# EasyEDA Pro project ProPrj_Nebula_2026-02-20 (1).epro

# Schematic Schematic1
Board Name: Board1; Create Date: 2026-02-19; Page Name: P1; Project Name: Nebula; Schematic Name: Schematic1; Update Date: 2026-02-19; Company: EasyEDA.com; Page Size: A4; Version: V1.0
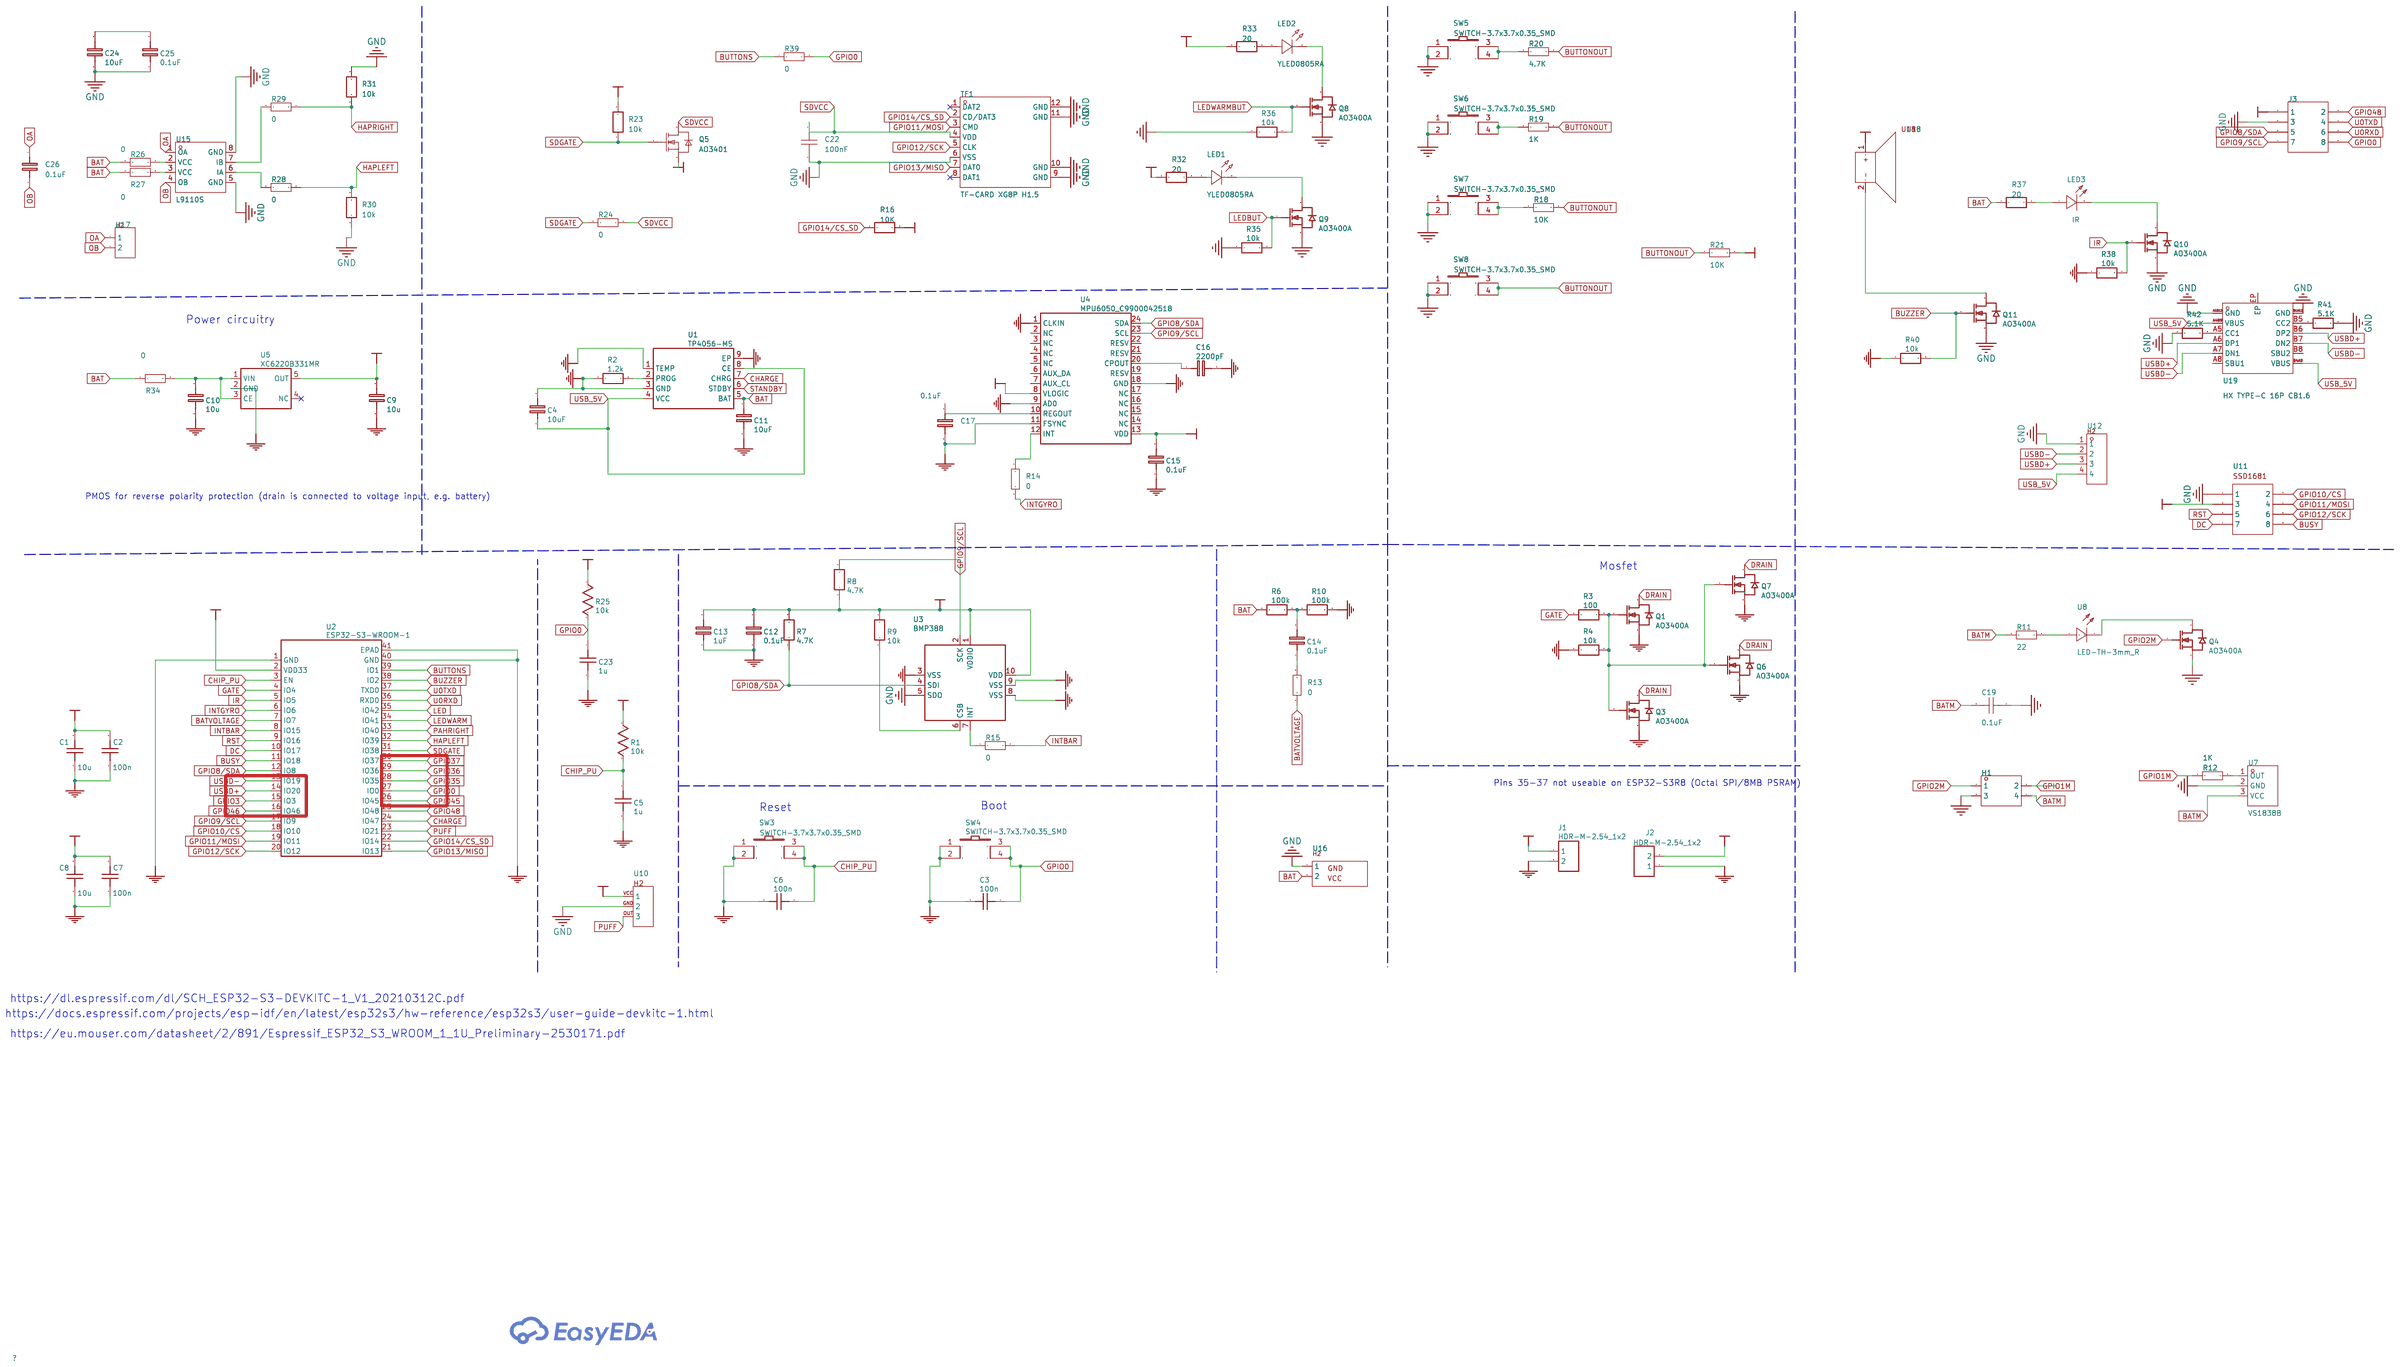
[diagram p0: schematic sheet]

## Parts
C1  10u  [C0805]
C2  100n  [C0805]
C3  100n  [C0805]
C4  10uF  [C0805]
C5  1u  [C0805]
C6  100n  [C0805]
C7  100n  [C0805]
C8  10u  [C0805]
C9  10u  [C0805]
C10  10u  [C0805]
C11  10uF  [C0805]
C12  0.1uF  [C0805]
C13  1uF  [C0805]
C14  0.1uF  [C0805]
C15  0.1uF  [C0805]
C16  2200pF  [C0805]
C17  0.1uF  [C0805]
C19  0.1uF  [C0805]
C22  100nF  [C0805]
C23  1u  [C0805]
C24  10uF  [C0805]
C25  0.1uF  [C0805]
C26  0.1uF  [C0805]
H1  -  [HDR-TH_4P-P2.54-V-F-R2-C2-S2.54]
J1  HDR-M-2.54_1x2  [HDR-M-2.54_1X2]
J2  HDR-M-2.54_1x2  [HDR-M-2.54_1X2]
J3  -  [HDR-TH_8P-P1.27-V-F-R2-C4-S1.27]
LED1  YLED0805RA  [LED0805-FD]
LED2  YLED0805RA  [LED0805-FD]
LED3  IR  [LED-TH_BD3.8-P2.54-FD_ORANGE]
Q1  AO3400A  [SOT-23-3_L2.9-W1.3-P1.90-LS2.4-BR]
Q3  AO3400A  [SOT-23-3_L2.9-W1.3-P1.90-LS2.4-BR]
Q4  AO3400A  [SOT-23-3_L2.9-W1.3-P1.90-LS2.4-BR]
Q5  AO3401  [SOT-23-3_L2.9-W1.4-P1.90-LS2.5-BR]
Q6  AO3400A  [SOT-23-3_L2.9-W1.3-P1.90-LS2.4-BR]
Q7  AO3400A  [SOT-23-3_L2.9-W1.3-P1.90-LS2.4-BR]
Q8  AO3400A  [SOT-23-3_L2.9-W1.3-P1.90-LS2.4-BR]
Q9  AO3400A  [SOT-23-3_L2.9-W1.3-P1.90-LS2.4-BR]
Q10  AO3400A  [SOT-23-3_L2.9-W1.3-P1.90-LS2.4-BR]
Q11  AO3400A  [SOT-23-3_L2.9-W1.3-P1.90-LS2.4-BR]
R1  10k  [R0805]
R2  1.2k  [R0805]
R3  100  [R0805]
R4  10k  [R0805]
R6  100k  [R0805]
R7  4.7K  [R0805]
R8  4.7K  [R0805]
R9  10k  [R0805]
R10  100k  [R0805]
R11  22  [R0805]
R12  1K  [R0805]
R13  0  [0402]
R14  0  [0402]
R15  0  [0402]
R16  10K  [R0805]
R18  10K  [R0805]
R19  1K  [R0805]
R20  4.7K  [R0805]
R21  10K  [R0805]
R23  10k  [R0805]
R24  0  [0402]
R25  10k  [R0805]
R26  0  [0402]
R27  0  [0402]
R28  0  [0402]
R29  0  [0402]
R30  10k  [R0805]
R31  10k  [R0805]
R32  20  [R0805]
R33  20  [R0805]
R34  0  [0402]
R35  10k  [R0805]
R36  10k  [R0805]
R37  20  [R0805]
R38  10k  [R0805]
R39  0  [0402]
R40  10k  [R0805]
R41  5.1K  [R0805]
R42  5.1K  [R0805]
SW3  SWITCH-3.7x3.7x0.35_SMD  [SW-SMD_4P-L3.7-W3.7-P2.75-LS3.7]
SW4  SWITCH-3.7x3.7x0.35_SMD  [SW-SMD_4P-L3.7-W3.7-P2.75-LS3.7]
SW5  SWITCH-3.7x3.7x0.35_SMD  [SW-SMD_4P-L3.7-W3.7-P2.75-LS3.7]
SW6  SWITCH-3.7x3.7x0.35_SMD  [SW-SMD_4P-L3.7-W3.7-P2.75-LS3.7]
SW7  SWITCH-3.7x3.7x0.35_SMD  [SW-SMD_4P-L3.7-W3.7-P2.75-LS3.7]
SW8  SWITCH-3.7x3.7x0.35_SMD  [SW-SMD_4P-L3.7-W3.7-P2.75-LS3.7]
TF1  TF-CARD XG8P H1.5  [TF-SMD_TF-CARD-XG8P-H1.5]
U1  TP4056-MS  [SOP-8_L4.9-W3.9-P1.27-LS6.0-TL-EP]
U2  ESP32-S3-WROOM-1  [ESP32-S3-WROOM-1]
U3  BMP388  [SENSORM-SMD_BMP388]
U4  MPU6050_C9900042518  [QFN-24_L4.0-W4.0-P0.50-BL]
U5  XC6220B331MR  [SOT-23-5_L2.9-W1.6-P0.95-LS2.8-BR]
U7  VS1838B  [OPTO-TH_VS1838B]
U8  LED-TH-3mm_R  [LED-TH_BD5.4-P2.54-FD_RED]
U10  -  [Puff sensor]
U11  -  [HDR-TH_8P-P0.6]
U12  -  [USB-CONNECTOR-4-PIN]
U15  L9110S  [SOP-8_L6.1-W3.9-P1.27-LS6.0-BL-1]
U16  -  [Battery Connector Nebula]
U17  -  [Haptic Nebula]
U18  -  [5030 smd buzzer passive nebula]
U19  HX TYPE-C 16P CB1.6  [USB-C-SMD_HX-TYPE-C-16PCB1.6]

## Library data of the parts
C1 C8 = 10u: nameAlias: Value(F); Contributor: LCEDA_Lib; spicePre: C; spiceSymbolName: C_0201_US
C2 C3 C6 C7 = 100n: nameAlias: Value(F); Contributor: LCEDA_Lib; spicePre: C; spiceSymbolName: C_0201_US
C4 C11 C24 = 10uF: nameAlias: Value(F); Contributor: LCEDA_Lib; spicePre: C; spiceSymbolName: C_0603_EU
C5 C23 = 1u: nameAlias: Value(F); Contributor: LCEDA_Lib; spicePre: C; spiceSymbolName: C_0201_US
C9 C10 = 10u: Supplier Part: C15849; Supplier: LCSC; Manufacturer Part: CL10A105KB8NNNC; Manufacturer: SAMSUNG; nameAlias: Value(F); Contributor: LCEDA_Lib; spicePre: C; spiceSymbolName: C_0603_EU
C12 C14 C15 C17 C25 C26 = 0.1uF: nameAlias: Value(F); Contributor: LCEDA_Lib; spicePre: C; spiceSymbolName: C_0603_EU
C13 = 1uF: nameAlias: Value(F); Contributor: LCEDA_Lib; spicePre: C; spiceSymbolName: C_0603_EU
C16 = 2200pF: nameAlias: Value(F); Contributor: LCEDA_Lib; spicePre: C; spiceSymbolName: C_0603_EU
C19 C22 = CAP_0201: Supplier Footprint: 0201
H1 = HDR-F_2.54_2x2: Supplier Footprint: Through
J1 J2 = HDR-M-2.54_1x2: Supplier Part: C124375; Supplier: LCSC; Contributor: LCEDA_Lib; spicePre: J
J3 = HDR-F-1.27_2x4: Supplier Footprint: Through
LED1 LED2 = YLED0805RA: Supplier Part: C52989003; Manufacturer: YONGYUTAI(永裕泰); Supplier Footprint: 0805; JLCPCB Part Class: Extended Part; Datasheet: https://item.szlcsc.com/datasheet/YLED0805RA/55918656.html; Supplier: LCSC
LED3 = LED橙发橙 3AO4UD: LCSC Part Name: 3mm LED橙发橙 3AO4UD; Supplier Part: C62095; Supplier Footprint: 插件; JLCPCB Part Class: Extended Part; Supplier: LCSC
Q1 Q3 Q4 Q6-Q11 = AO3400A: Supplier: LCSC; Manufacturer: AOS; Supplier Part: C20917; JLCPCB Part Class: Basic Part; spicePre: Q
Q5 = AO3401_C53261043: Supplier Part: C53261043; Manufacturer: GMIC(绿微); Supplier Footprint: SOT-23; JLCPCB Part Class: Extended Part; Datasheet: https://item.szlcsc.com/datasheet/AO3401/56319604.html; Supplier: LCSC
R1 R25 = 10k: nameAlias: Value(Ω); Contributor: LCEDA_Lib; spicePre: R; spiceSymbolName: R_0201_US
R2 R16 R32 R33 R37 = 1.2k: nameAlias: Value(Ω); Contributor: LCEDA_Lib; spicePre: R; spiceSymbolName: R_0603_EU
R3 = 100: nameAlias: Value(Ω); Contributor: LCEDA_Lib; spicePre: R; spiceSymbolName: R_0603_EU
R4 R7-R9 R23 R30 R31 R35 R36 R38 R40-R42 = 10k: nameAlias: Value(Ω); Contributor: LCEDA_Lib; spicePre: R; spiceSymbolName: R_0603_EU
R6 R10 = 100k: nameAlias: Value(Ω); Contributor: LCEDA_Lib; spicePre: R; spiceSymbolName: R_0603_EU
R11-R15 R24 R26-R29 R34 R39 = Res_0603: Supplier Footprint: 0603
R18-R21 = Res_0805: Supplier Footprint: 0805
SW3-SW8 = SWITCH-3.7x3.7x0.35_SMD: EasyEDA: E19636; Supplier Part: E19636; Supplier: EasyEDA; Manufacturer: BBJ; Contributor: Conrad Lagorio; spicePre: S
TF1 = TF-CARD XG8P H1.5: Card Connection Mode:Hinged Lid Card Type:MicroSD Card (TF Card) Connector Type:Connector and Ejector Additional Card Detection Pins:- Supplementary Features:- Height Above Board:1.5mm Operating Temperature:-25℃~+90℃ Operating Temperature:-25℃~+90℃; LCSC Part Name: 翻盖式 MicroSD卡(TF卡) 卡座; Supplier Part: C7529392; Manufacturer: SHOU HAN(首韩); Supplier Footprint: SMD; JLCPCB Part Class: Extended Part; Datasheet: https://item.szlcsc.com/datasheet/TF-CARD%2520XG8P%2520H1.5/8629779.html; Supplier: LCSC; Card Connection Mode: Hinged Lid; Card Type: MicroSD Card (TF Card); Connector Type: Connector and Ejector; Height Above Board: 1.5mm; Operating Temperature: -25℃~+90℃
U1 = TP4056-MS: Supplier: LCSC; Supplier Part: C7473158; Manufacturer: MSKSEMI(美森科); JLCPCB Part Class: Extended Part; Contributor: lcsc; spicePre: U
U2 = ESP32-S3-WROOM-1: Manufacturer: Espressif Systems; Contributor: max30012540; spicePre: U
U3 = BMP388: Supplier: LCSC; Supplier Part: C779278; Manufacturer: Bosch(博世); JLCPCB Part Class: Extended Part; Contributor: LCSC; spicePre: U
U4 = MPU6050_C9900042518: Supplier: LCSC; Supplier Part: C9900042518; Manufacturer: null; Manufacturer Part: MPU6050; Contributor: lcsc; spicePre: U
U5 = XC6220B331MR: Supplier: LCSC; Supplier Part: C3040644; Manufacturer: TECH PUBLIC(台舟); JLCPCB Part Class: Extended Part; Contributor: lcsc; spicePre: U
U7 = VS1838B: Supplier Part: C9900002107; Supplier Footprint: TH-3_4.8X6.7X2.54P; JLCPCB Part Class: Extended Part; Supplier: LCSC
U8 = LED-TH-3mm_R: Supplier Part: C9900003210; Supplier Footprint: LED-TH_BD3.0_RED; JLCPCB Part Class: Extended Part; Supplier: LCSC
U10 = Puff sensor
U11 = HDR-TH_8P-P0.6
U12 = USB-CONNECTOR-OUT
U15 = L9110S_C725793: Control Voltage:- Control Voltage:- Output Current:- Output Current:- Technology:- Operating Temperature:-30℃~+85℃ Operating Temperature:-30℃~+85℃; LCSC Part Name: 低功耗; Supplier Part: C725793; Manufacturer: UMW(友台半导体); Supplier Footprint: SOP-8; JLCPCB Part Class: Extended Part; Datasheet: https://item.szlcsc.com/datasheet/L9110S/772196.html; Supplier: LCSC; Operating Temperature: -30℃~+85℃
U16 = Battery Connector Nebula
U17 = Nebula Haptic
U18 = 5030 smd buzzer passive
U19 = HX TYPE-C 16P CB1.6: Connector Type:Type-C Protocol Standard:USB 3.1 Gender:Female Mounting Type:Recessed Mount Number of Contacts:16P Number of Ports:1 Current Rating-Power:3A Voltage Rating:20V Connect-Disconnect Life:5,000 Cycles Supplementary Features:- Center Height:0.08; LCSC Part Name: Type-C 母 沉板; Supplier Part: C5178543; Manufacturer: hanxia(韩下); Supplier Footprint: SMD; JLCPCB Part Class: Extended Part; Datasheet: https://item.szlcsc.com/datasheet/HX%2520TYPE-C%252016P%2520CB1.6/5834065.html; Supplier: LCSC; Connector Type: Type-C; Protocol Standard: USB 3.1; Gender: Female; Mounting Type: Recessed Mount; Number of Contacts: 16P; Number of Ports: 1; Current Rating-Power: 3A; Voltage Rating: 20V; Connect-Disconnect Life: 5,000 Cycles; Center Height: 0.08mm; Length: 6.5mm; Detection color: Black; Operating Temperature: -30℃~+80℃

## Nets
3V3: C1.2 C2.2 C7.2 C8.2 C9.1 C12.2 C13.2 C15.2 J1.1 J3.1 Q5.2(S) R1.1 R7.2 R8.1 R9.2 R16.2 R23.2 R25.1 R32.1 R33.1 U2.2(VDD33) U3.1(VDDIO) U3.10(VDD) U4.8(VLOGIC) U4.13(VDD) U5.5(OUT) U10.VCC(1) U11.3 U18.1
3V3_BUT: R21.2
GND: C1.1 C2.1 C3.2 C4.2 C5.2 C6.2 C7.1 C8.1 C9.2 C10.2 C11.2 C12.1 C13.1 C15.1 C16.2 C17.2 C22.2 C23.2 C24.1 C25.1 J1.2 J2.1 J3.3 Q1.2(S) Q3.2(S) Q6.2(S) Q7.2(S) Q10.2(S) Q11.2(S) R2.1 R4.1 R10.2 R30.1 R31.2 R38.1 R40.1 R41.2 R42.1 SW3.1 SW3.2 SW4.1 SW4.2 TF1.6(VSS) TF1.9(GND) TF1.10(GND) TF1.11(GND) TF1.12(GND) U1.1(TEMP) U1.3(GND) U1.9(EP) U2.1(GND) U2.40(GND) U2.41(EPAD) U3.3(VSS) U3.5(SDO) U3.8(VSS) U3.9(VSS) U4.1(CLKIN) U4.9(AD0) U4.11(FSYNC) U4.18(GND) U5.2(GND) U10.GND(2) U11.1 U12.1 U15.5(GND) U15.8(GND) U16.1 U19.A1B12(GND) U19.B1A12(GND)
GND_BUT: Q8.2(S) Q9.2(S) R35.1 R36.1 SW5.1 SW5.2 SW6.1 SW6.2 SW7.1 SW7.2 SW8.1 SW8.2
GNDM: C19.1 H1.3 Q4.2(S) U7.2(GND)
VIN: J2.2
BAT: C11.1 R6.1 R26.1 R27.1 R34.1 R37.1 U1.5(BAT) U16.2
BATM: C19.2 H1.4 R11.1 U7.3(VCC)
BATVOLTAGE: R13.1 U2.7(IO7)
BUSY: U2.11(IO18) U11.8
BUTTONOUT: R18.2 R19.2 R20.2 R21.1 SW8.3 SW8.4
BUTTONS: R39.1 U2.39(IO1)
BUZZER: Q11.1(G) R40.2 U2.38(IO2)
CHARGE: U1.7(CHRG) U2.24(IO47)
CHIP_PU: C5.1 C6.1 R1.2 SW3.3 SW3.4 U2.3(EN)
DC: U2.10(IO17) U11.7
DRAIN: Q1.3(D) Q3.3(D) Q6.3(D) Q7.3(D)
GATE: R3.1 U2.4(IO4)
GPIO0: C3.1 C23.1 J3.8 R25.2 R39.2 SW4.3 SW4.4 U2.27(IO0)
GPIO1M: H1.2 R12.1
GPIO2M: H1.1 Q4.1(G)
GPIO3: U2.15(IO3)
GPIO8/SDA: J3.5 R7.1 U2.12(IO8) U3.4(SDI) U4.24(SDA)
GPIO9/SCL: J3.7 R8.2 U2.17(IO9) U3.2(SCK) U4.23(SCL)
GPIO10/CS: U2.18(IO10) U11.2
GPIO11/MOSI: TF1.3(CMD) U2.19(IO11) U11.4
GPIO12/SCK: TF1.5(CLK) U2.20(IO12) U11.6
GPIO13/MISO: TF1.7(DAT0) U2.21(IO13)
GPIO14/CS_SD: R16.1 TF1.2(CD/DAT3) U2.22(IO14)
GPIO35: U2.28(IO35)
GPIO36: U2.29(IO36)
GPIO37: U2.30(IO37)
GPIO45: U2.26(IO45)
GPIO46: U2.16(IO46)
GPIO48: J3.2 U2.25(IO48)
HAPLEFT: R28.1 R30.2 U2.32(IO39)
HAPRIGHT: R29.1 R31.1
INTBAR: R15.2 U2.8(IO15)
INTGYRO: R14.2 U2.6(IO6)
IR: Q10.1(G) R38.2 U2.5(IO5)
LED: U2.35(IO42)
LEDBUT: Q9.1(G) R35.2
LEDWARM: U2.34(IO41)
LEDWARMBUT: Q8.1(G) R36.2
OA: C26.1 U15.1(OA) U17.1
OB: C26.2 U15.4(OB) U17.2
PAHRIGHT: U2.33(IO40)
PUFF: U2.23(IO21) U10.OUT(3)
RST: U2.9(IO16) U11.5
SDGATE: Q5.1(G) R23.1 R24.1 U2.31(IO38)
SDVCC: C22.1 Q5.3(D) R24.2 TF1.4(VDD)
STANDBY: U1.6(STDBY)
U0RXD: J3.6 U2.36(RXD0)
U0TXD: J3.4 U2.37(TXD0)
USB_5V: C4.1 U1.4(VCC) U1.8(CE) U12.4 U19.A4B9(VBUS) U19.B4A9(VBUS)
USBD+: U2.14(IO20) U12.3 U19.A6(DP1) U19.B6(DP2)
USBD-: U2.13(IO19) U12.2 U19.A7(DN1) U19.B7(DN2)
Net-(C10-1): C10.1 R34.2 U5.1(VIN) U5.3(CE)
Net-(C14-1): C14.1 R13.2
Net-(C14-2): C14.2 R6.2 R10.1
Net-(C16-1): C16.1 U4.20(CPOUT)
Net-(C24-2): C24.2 C25.2
Net-(LED1-1): LED1.1(A) R32.2
Net-(LED1-2): LED1.2(C) Q9.3(D)
Net-(LED2-1): LED2.1(A) R33.2
Net-(LED2-2): LED2.2(C) Q8.3(D)
Net-(LED3-1): LED3.1(A) R37.2
Net-(LED3-2): LED3.2(K) Q10.3(D)
Net-(Q1-1): Q1.1(G) Q3.1(G) Q6.1(G) Q7.1(G) R3.2 R4.2
Net-(Q4-3): Q4.3(D) U8.2
Net-(Q11-3): Q11.3(D) U18.2
Net-(R2-2): R2.2 U1.2(PROG)
Net-(R9-1): R9.1 U3.6(CSB)
Net-(R11-2): R11.2 U8.1
Net-(R12-2): R12.2 U7.1(OUT)
Net-(R14-1): R14.1 U4.12(INT)
Net-(R15-1): R15.1 U3.7(INT)
Net-(R18-1): R18.1 SW7.3 SW7.4
Net-(R19-1): R19.1 SW6.3 SW6.4
Net-(R20-1): R20.1 SW5.3 SW5.4
Net-(R26-2): R26.2 U15.2(VCC)
Net-(R27-2): R27.2 U15.3(VCC)
Net-(R28-2): R28.2 U15.6(IA)
Net-(R29-2): R29.2 U15.7(IB)
Net-(R41-1): R41.1 U19.B5(CC2)
Net-(R42-2): R42.2 U19.A5(CC1)

Not connected (* = marked no-connect by the designer): C17 1; TF1 1(DAT2)* 8(DAT1)*; U4 2(NC) 3(NC) 4(NC) 5(NC) 6(AUX_DA) 7(AUX_CL) 10(REGOUT) 14(NC) 15(NC) 16(NC) 17(NC) 19(RESV) 21(RESV) 22(RESV); U5 4(NC)*; U19 A8(SBU1) B8(SBU2) EP

## Notes on the sheet
- Power circuitry
- PMOS for reverse polarity protection (drain is connected to voltage input, e.g. battery)
- Mosfet
- Pins 35-37 not useable on ESP32-S3R8 (Octal SPI/8MB PSRAM)
- Reset
- Boot
- https://dl.espressif.com/dl/SCH_ESP32-S3-DEVKITC-1_V1_20210312C.pdf
- https://docs.espressif.com/projects/esp-idf/en/latest/esp32s3/hw-reference/esp32s3/user-guide-devkitc-1.html
- https://eu.mouser.com/datasheet/2/891/Espressif_ESP32_S3_WROOM_1_1U_Preliminary-2530171.pdf

# Schematic Schematic2
Board Name: PCB2; Create Date: 2026-02-19; Page Name: P1; Project Name: Nebula; Schematic Name: Schematic2; Update Date: 2026-02-20; Company: EasyEDA.com; Page Size: A4; Version: V1.0
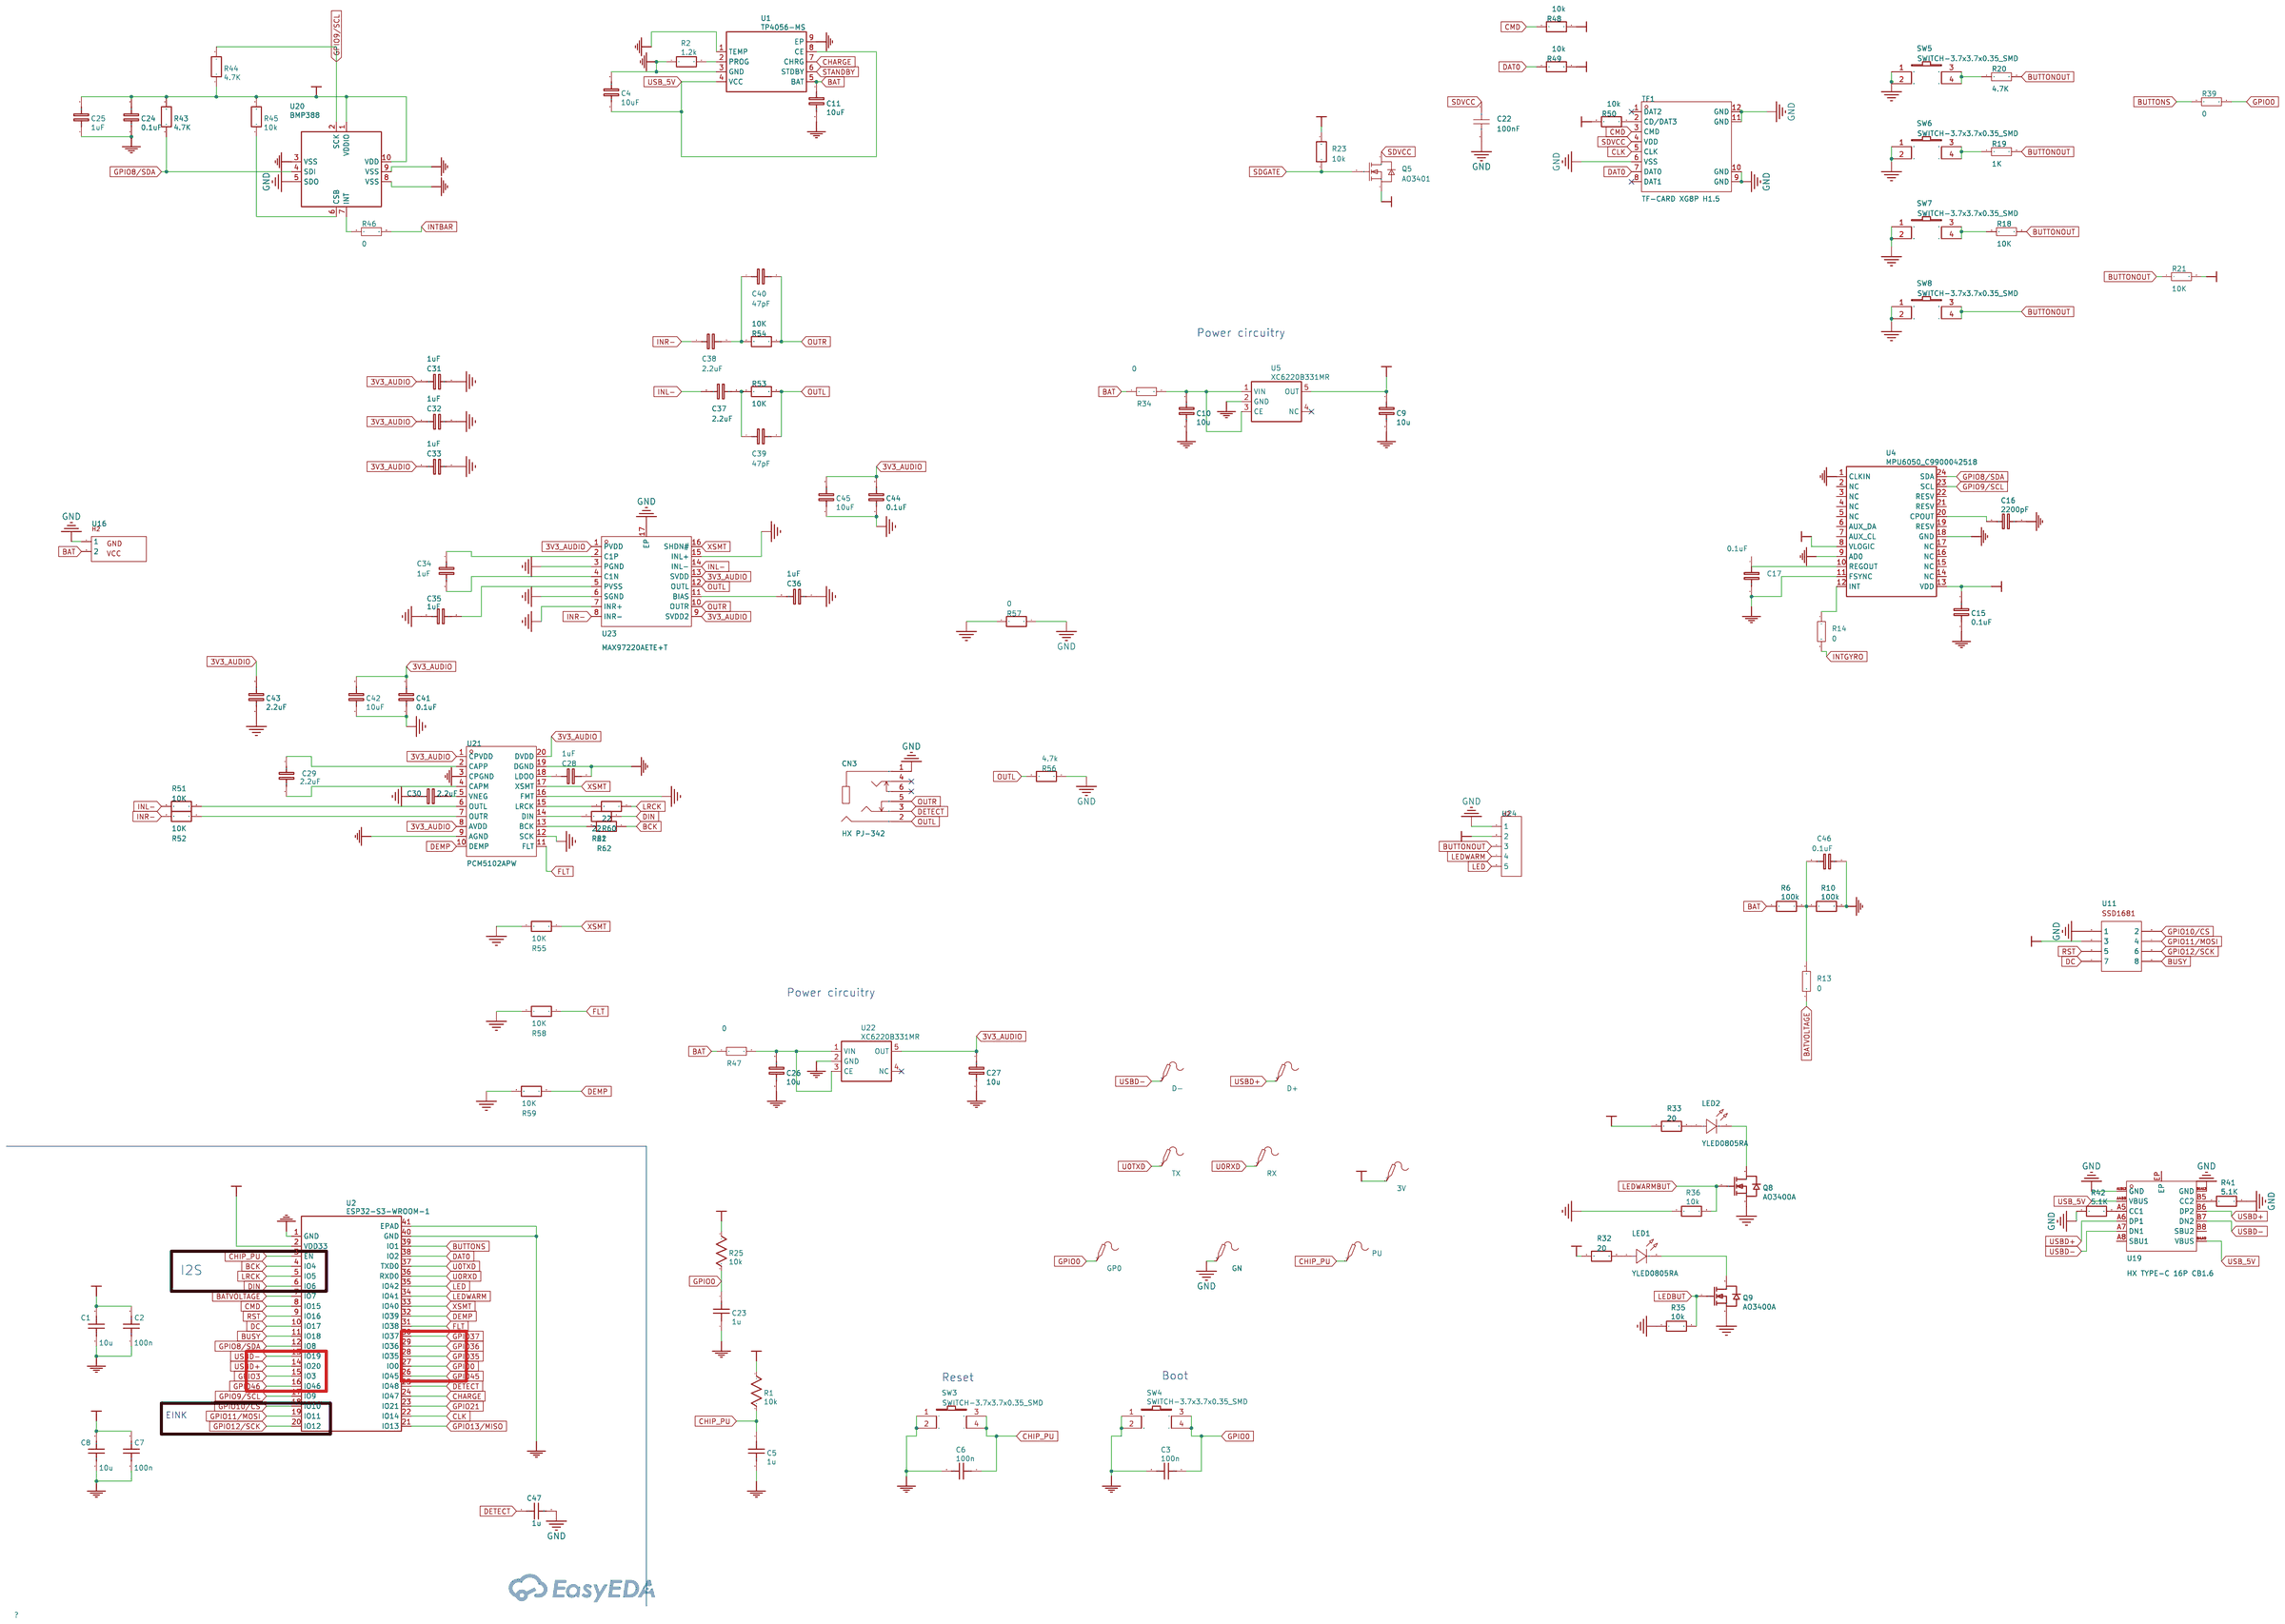
[diagram p1: schematic sheet]

## Parts
3V  -  [Test-Point-0.5mm]
C1  10u  [C0805]
C2  100n  [C0805]
C3  100n  [C0805]
C4  10uF  [C0805]
C5  1u  [C0805]
C6  100n  [C0805]
C7  100n  [C0805]
C8  10u  [C0805]
C9  10u  [C0805]
C10  10u  [C0805]
C11  10uF  [C0805]
C15  0.1uF  [C0805]
C16  2200pF  [C0805]
C17  0.1uF  [C0805]
C22  100nF  [C0805]
C23  1u  [C0805]
C24  0.1uF  [C0805]
C25  1uF  [C0805]
C26  10u  [C0805]
C27  10u  [C0805]
C28  1uF  [C0805]
C29  2.2uF  [C0805]
C30  2.2uF  [C0805]
C31  1uF  [C0805]
C32  1uF  [C0805]
C33  1uF  [C0805]
C34  1uF  [C0805]
C35  1uF  [C0805]
C36  1uF  [C0805]
C37  2.2uF  [C0805]
C38  2.2uF  [C0805]
C39  47pF  [C0805]
C40  47pF  [C0805]
C41  0.1uF  [C0805]
C42  10uF  [C0805]
C43  2.2uF  [C0805]
C44  0.1uF  [C0805]
C45  10uF  [C0805]
C46  0.1uF  [C0805]
C47  1u  [C0805]
CN3  HX PJ-342  [AUDIO-SMD_HX-PJ-342M]
D+  -  [Test-Point-0.5mm]
D-  -  [Test-Point-0.5mm]
GN  -  [Test-Point-0.5mm]
GP0  -  [Test-Point-0.5mm]
LED1  YLED0805RA  [LED0805-FD]
LED2  YLED0805RA  [LED0805-FD]
PU  -  [Test-Point-0.5mm]
Q5  AO3401  [SOT-23-3_L2.9-W1.4-P1.90-LS2.5-BR]
Q8  AO3400A  [SOT-23-3_L2.9-W1.3-P1.90-LS2.4-BR]
Q9  AO3400A  [SOT-23-3_L2.9-W1.3-P1.90-LS2.4-BR]
R1  10k  [R0805]
R2  1.2k  [R0805]
R6  100k  [R0805]
R10  100k  [R0805]
R13  0  [0402]
R14  0  [0402]
R18  10K  [R0805]
R19  1K  [R0805]
R20  4.7K  [R0805]
R21  10K  [R0805]
R23  10k  [R0805]
R25  10k  [R0805]
R32  20  [R0805]
R33  20  [R0805]
R34  0  [0402]
R35  10k  [R0805]
R36  10k  [R0805]
R39  0  [0402]
R41  5.1K  [R0805]
R42  5.1K  [R0805]
R43  4.7K  [R0805]
R44  4.7K  [R0805]
R45  10k  [R0805]
R46  0  [0402]
R47  0  [0402]
R48  10k  [R0805]
R49  10k  [R0805]
R50  10k  [R0805]
R51  10K  [R0805]
R52  10K  [R0805]
R53  10K  [R0805]
R54  10K  [R0805]
R55  10K  [R0805]
R56  4.7k  [R0805]
R57  0  [R0805]
R58  10K  [R0805]
R59  10K  [R0805]
R60  22  [R0805]
R61  22  [R0805]
R62  22  [R0805]
RX  -  [Test-Point-0.5mm]
SW3  SWITCH-3.7x3.7x0.35_SMD  [SW-SMD_4P-L3.7-W3.7-P2.75-LS3.7]
SW4  SWITCH-3.7x3.7x0.35_SMD  [SW-SMD_4P-L3.7-W3.7-P2.75-LS3.7]
SW5  SWITCH-3.7x3.7x0.35_SMD  [SW-SMD_4P-L3.7-W3.7-P2.75-LS3.7]
SW6  SWITCH-3.7x3.7x0.35_SMD  [SW-SMD_4P-L3.7-W3.7-P2.75-LS3.7]
SW7  SWITCH-3.7x3.7x0.35_SMD  [SW-SMD_4P-L3.7-W3.7-P2.75-LS3.7]
SW8  SWITCH-3.7x3.7x0.35_SMD  [SW-SMD_4P-L3.7-W3.7-P2.75-LS3.7]
TF1  TF-CARD XG8P H1.5  [TF-SMD_TF-CARD-XG8P-H1.5]
TX  -  [Test-Point-0.5mm]
U1  TP4056-MS  [SOP-8_L4.9-W3.9-P1.27-LS6.0-TL-EP]
U2  ESP32-S3-WROOM-1  [ESP32-S3-WROOM-1]
U4  MPU6050_C9900042518  [QFN-24_L4.0-W4.0-P0.50-BL]
U5  XC6220B331MR  [SOT-23-5_L2.9-W1.6-P0.95-LS2.8-BR]
U11  -  [HDR-TH_8P-P0.6]
U16  -  [Battery Connector Nebula]
U19  HX TYPE-C 16P CB1.6  [USB-C-SMD_HX-TYPE-C-16PCB1.6]
U20  BMP388  [SENSORM-SMD_BMP388]
U21  PCM5102APW  [TSSOP-20_L6.5-W4.4-P0.65-LS6.4-BL]
U22  XC6220B331MR  [SOT-23-5_L2.9-W1.6-P0.95-LS2.8-BR]
U23  MAX97220AETE+T  [QFN-16_L3.0-W3.0-P0.50-BL-EP1.5]
U24  -  [Nebula buttons board]

## Library data of the parts
3V D+ D- GN GP0 PU RX TX = Test-Point: Test Point 测试点
C1 C8 = 10u: nameAlias: Value(F); Contributor: LCEDA_Lib; spicePre: C; spiceSymbolName: C_0201_US
C2 C3 C6 C7 = 100n: nameAlias: Value(F); Contributor: LCEDA_Lib; spicePre: C; spiceSymbolName: C_0201_US
C4 C11 = 10uF: nameAlias: Value(F); Contributor: LCEDA_Lib; spicePre: C; spiceSymbolName: C_0603_EU
C5 C23 C47 = 1u: nameAlias: Value(F); Contributor: LCEDA_Lib; spicePre: C; spiceSymbolName: C_0201_US
C9 C10 C26 C27 C31-C36 = 10u: Supplier Part: C15849; Supplier: LCSC; Manufacturer Part: CL10A105KB8NNNC; Manufacturer: SAMSUNG; nameAlias: Value(F); Contributor: LCEDA_Lib; spicePre: C; spiceSymbolName: C_0603_EU
C15 C17 C24 C29 C30 C37-C41 C44 C46 = 0.1uF: nameAlias: Value(F); Contributor: LCEDA_Lib; spicePre: C; spiceSymbolName: C_0603_EU
C16 = 2200pF: nameAlias: Value(F); Contributor: LCEDA_Lib; spicePre: C; spiceSymbolName: C_0603_EU
C22 = CAP_0201: Supplier Footprint: 0201
C25 C28 C42 C43 C45 = 1uF: nameAlias: Value(F); Contributor: LCEDA_Lib; spicePre: C; spiceSymbolName: C_0603_EU
CN3 = HX PJ-342: Connector Type:3.5mm Headphone Jack Current Rating:500mA Voltage Rating (Max):30V Operating Temperature:-30℃~+70℃ Operating Temperature:-30℃~+70℃; Supplier Part: C5184835; Manufacturer: hanxia(韩下); Supplier Footprint: SMD; JLCPCB Part Class: Extended Part; Datasheet: https://item.szlcsc.com/datasheet/HX%2520PJ-342/5851214.html; Supplier: LCSC; Connector Type: 3.5mm Headphone Jack; Current Rating: 500mA; Voltage Rating (Max): 30V; Operating Temperature: -30℃~+70℃
LED1 LED2 = YLED0805RA: Supplier Part: C52989003; Manufacturer: YONGYUTAI(永裕泰); Supplier Footprint: 0805; JLCPCB Part Class: Extended Part; Datasheet: https://item.szlcsc.com/datasheet/YLED0805RA/55918656.html; Supplier: LCSC
Q5 = AO3401_C53261043: Supplier Part: C53261043; Manufacturer: GMIC(绿微); Supplier Footprint: SOT-23; JLCPCB Part Class: Extended Part; Datasheet: https://item.szlcsc.com/datasheet/AO3401/56319604.html; Supplier: LCSC
Q8 Q9 = AO3400A: Supplier: LCSC; Manufacturer: AOS; Supplier Part: C20917; JLCPCB Part Class: Basic Part; spicePre: Q
R1 R25 = 10k: nameAlias: Value(Ω); Contributor: LCEDA_Lib; spicePre: R; spiceSymbolName: R_0201_US
R2 R32 R33 = 1.2k: nameAlias: Value(Ω); Contributor: LCEDA_Lib; spicePre: R; spiceSymbolName: R_0603_EU
R6 R10 = 100k: nameAlias: Value(Ω); Contributor: LCEDA_Lib; spicePre: R; spiceSymbolName: R_0603_EU
R13 R14 R34 R39 R46 R47 = Res_0603: Supplier Footprint: 0603
R18-R21 = Res_0805: Supplier Footprint: 0805
R23 R35 R36 R41-R45 R48-R62 = 10k: nameAlias: Value(Ω); Contributor: LCEDA_Lib; spicePre: R; spiceSymbolName: R_0603_EU
SW3-SW8 = SWITCH-3.7x3.7x0.35_SMD: EasyEDA: E19636; Supplier Part: E19636; Supplier: EasyEDA; Manufacturer: BBJ; Contributor: Conrad Lagorio; spicePre: S
TF1 = TF-CARD XG8P H1.5: Card Connection Mode:Hinged Lid Card Type:MicroSD Card (TF Card) Connector Type:Connector and Ejector Additional Card Detection Pins:- Supplementary Features:- Height Above Board:1.5mm Operating Temperature:-25℃~+90℃ Operating Temperature:-25℃~+90℃; LCSC Part Name: 翻盖式 MicroSD卡(TF卡) 卡座; Supplier Part: C7529392; Manufacturer: SHOU HAN(首韩); Supplier Footprint: SMD; JLCPCB Part Class: Extended Part; Datasheet: https://item.szlcsc.com/datasheet/TF-CARD%2520XG8P%2520H1.5/8629779.html; Supplier: LCSC; Card Connection Mode: Hinged Lid; Card Type: MicroSD Card (TF Card); Connector Type: Connector and Ejector; Height Above Board: 1.5mm; Operating Temperature: -25℃~+90℃
U1 = TP4056-MS: Supplier: LCSC; Supplier Part: C7473158; Manufacturer: MSKSEMI(美森科); JLCPCB Part Class: Extended Part; Contributor: lcsc; spicePre: U
U2 = ESP32-S3-WROOM-1: Manufacturer: Espressif Systems; Contributor: max30012540; spicePre: U
U4 = MPU6050_C9900042518: Supplier: LCSC; Supplier Part: C9900042518; Manufacturer: null; Manufacturer Part: MPU6050; Contributor: lcsc; spicePre: U
U5 U22 = XC6220B331MR: Supplier: LCSC; Supplier Part: C3040644; Manufacturer: TECH PUBLIC(台舟); JLCPCB Part Class: Extended Part; Contributor: lcsc; spicePre: U
U11 = HDR-TH_8P-P0.6
U16 = Battery Connector Nebula
U19 = HX TYPE-C 16P CB1.6: Connector Type:Type-C Protocol Standard:USB 3.1 Gender:Female Mounting Type:Recessed Mount Number of Contacts:16P Number of Ports:1 Current Rating-Power:3A Voltage Rating:20V Connect-Disconnect Life:5,000 Cycles Supplementary Features:- Center Height:0.08; LCSC Part Name: Type-C 母 沉板; Supplier Part: C5178543; Manufacturer: hanxia(韩下); Supplier Footprint: SMD; JLCPCB Part Class: Extended Part; Datasheet: https://item.szlcsc.com/datasheet/HX%2520TYPE-C%252016P%2520CB1.6/5834065.html; Supplier: LCSC; Connector Type: Type-C; Protocol Standard: USB 3.1; Gender: Female; Mounting Type: Recessed Mount; Number of Contacts: 16P; Number of Ports: 1; Current Rating-Power: 3A; Voltage Rating: 20V; Connect-Disconnect Life: 5,000 Cycles; Center Height: 0.08mm; Length: 6.5mm; Detection color: Black; Operating Temperature: -30℃~+80℃
U20 = BMP388: Supplier: LCSC; Supplier Part: C779278; Manufacturer: Bosch(博世); JLCPCB Part Class: Extended Part; Contributor: LCSC; spicePre: U
U21 = PCM5102APW: Resolution:32 Number of Channels:2 Voltage - Supply:1.8V~3.6V Voltage - Supply:1.8V~3.6V Interface Type:I2S Operating Temperature:-25℃~+85℃ Operating Temperature:-25℃~+85℃; LCSC Part Name: PCM5102A, PCM5101A, PCM5100A 2.1VRMS 112/106/100dB 音频立体声DAC; Supplier Part: C1520792; Manufacturer: TI(德州仪器); Supplier Footprint: TSSOP-20; JLCPCB Part Class: Extended Part; Datasheet: https://www.ti.com/cn/lit/gpn/pcm5102a; Supplier: LCSC; Resolution: 32; Number of Channels: 2; Voltage - Supply: 1.8V~3.6V; Interface Type: I2S; Operating Temperature: -25℃~+85℃
U23 = MAX97220AETE+T: Class:- Speaker Channels:2-Channel Output Power:125mWx2@32Ω Voltage - Supply:2.5V~5.5V Voltage - Supply:2.5V~5.5V Total Harmonic Distortion + Noise (THD+N):0.0035% Quiescent Current:7mA Operating Temperature:-40℃~+85℃ Operating Temperature:-40℃~+85℃ Signa; LCSC Part Name: 差分输入直驱线路驱动器/耳机放大器; Supplier Part: C2682711; Manufacturer: ADI(亚德诺)/MAXIM(美信); Supplier Footprint: QFN-16-EP(3x3); JLCPCB Part Class: Extended Part; Datasheet: https://item.szlcsc.com/datasheet/MAX97220AETE%252BT/2777742.html; Supplier: LCSC; Speaker Channels: 2-Channel; Output Power: 125mWx2@32Ω; Voltage - Supply: 2.5V~5.5V; Total Harmonic Distortion + Noise (THD+N): 0.0035%; Quiescent Current: 7mA; Operating Temperature: -40℃~+85℃; Signal-to-Noise Ratio: 112.5dB; Input Type: Differential; Power Supply Rejection Ratio (PSRR): 90dB
U24 = Nebula button board

## Nets
3V3: 3V.1 C1.2 C2.2 C7.2 C8.2 C9.1 C15.2 C24.2 C25.2 Q5.2(S) R1.1 R23.2 R25.1 R32.1 R33.1 R43.2 R44.1 R45.2 R48.2 R49.2 R50.2 U2.2(VDD33) U4.8(VLOGIC) U4.13(VDD) U5.5(OUT) U11.3 U20.1(VDDIO) U20.10(VDD) U24.2
3V3_AUDIO: C27.1 C31.2 C32.2 C33.2 C41.2 C42.2 C43.2 C44.2 C45.2 U21.1(CPVDD) U21.8(AVDD) U21.20(DVDD) U22.5(OUT) U23.1(PVDD) U23.9(SVDD2) U23.13(SVDD)
3V3_BUT: R21.2
AGND: C26.2 C27.2 C28.2 C30.1 C31.1 C32.1 C33.1 C35.1 C36.1 C41.1 C42.1 C43.1 C44.1 C45.1 R55.2 R57.2 R58.2 R59.2 U21.3(CPGND) U21.9(AGND) U21.12(SCK) U21.16(FMT) U21.19(DGND) U22.2(GND) U23.3(PGND) U23.6(SGND) U23.7(INR+) U23.15(INL+)
GND: C1.1 C2.1 C3.2 C4.2 C5.2 C6.2 C7.1 C8.1 C9.2 C10.2 C11.2 C15.1 C16.2 C17.2 C22.2 C23.2 C24.1 C25.1 C46.1 C47.2 CN3.1 GN.1 R2.1 R10.2 R41.2 R42.1 R56.1 R57.1 SW3.1 SW3.2 SW4.1 SW4.2 TF1.6(VSS) TF1.9(GND) TF1.10(GND) TF1.11(GND) TF1.12(GND) U1.1(TEMP) U1.3(GND) U1.9(EP) U2.1(GND) U2.40(GND) U2.41(EPAD) U4.1(CLKIN) U4.9(AD0) U4.11(FSYNC) U4.18(GND) U5.2(GND) U11.1 U16.1 U19.A1B12(GND) U19.B1A12(GND) U20.3(VSS) U20.5(SDO) U20.8(VSS) U20.9(VSS) U23.17(EP) U24.1
GND_BUT: Q8.2(S) Q9.2(S) R35.1 R36.1 SW5.1 SW5.2 SW6.1 SW6.2 SW7.1 SW7.2 SW8.1 SW8.2
BAT: C11.1 R6.1 R34.1 R47.1 U1.5(BAT) U16.2
BATVOLTAGE: R13.1 U2.7(IO7)
BCK: R62.1 U2.4(IO4)
BUSY: U2.11(IO18) U11.8
BUTTONOUT: R18.2 R19.2 R20.2 R21.1 SW8.3 SW8.4 U24.3
BUTTONS: R39.1 U2.39(IO1)
CHARGE: U1.7(CHRG) U2.24(IO47)
CHIP_PU: C5.1 C6.1 PU.1 R1.2 SW3.3 SW3.4 U2.3(EN)
CLK: TF1.5(CLK) U2.22(IO14)
CMD: R48.1 TF1.3(CMD) U2.8(IO15)
DAT0: R49.1 TF1.7(DAT0) U2.38(IO2)
DC: U2.10(IO17) U11.7
DEMP: R59.1 U2.32(IO39) U21.10(DEMP)
DETECT: C47.1 CN3.3 U2.25(IO48)
DIN: R61.1 U2.6(IO6)
FLT: R58.1 U2.31(IO38) U21.11(FLT)
GPIO0: C3.1 C23.1 GP0.1 R25.2 R39.2 SW4.3 SW4.4 U2.27(IO0)
GPIO3: U2.15(IO3)
GPIO8/SDA: R43.1 U2.12(IO8) U4.24(SDA) U20.4(SDI)
GPIO9/SCL: R44.2 U2.17(IO9) U4.23(SCL) U20.2(SCK)
GPIO10/CS: U2.18(IO10) U11.2
GPIO11/MOSI: U2.19(IO11) U11.4
GPIO12/SCK: U2.20(IO12) U11.6
GPIO13/MISO: U2.21(IO13)
GPIO21: U2.23(IO21)
GPIO35: U2.28(IO35)
GPIO36: U2.29(IO36)
GPIO37: U2.30(IO37)
GPIO45: U2.26(IO45)
GPIO46: U2.16(IO46)
INL-: C37.1 R51.2 U23.14(INL-)
INR-: C38.1 R52.2 U23.8(INR-)
INTBAR: R46.2
INTGYRO: R14.2
LED: U2.35(IO42) U24.5
LEDBUT: Q9.1(G) R35.2
LEDWARM: U2.34(IO41) U24.4
LEDWARMBUT: Q8.1(G) R36.2
LRCK: R60.1 U2.5(IO5)
OUTL: C39.2 CN3.2 R53.2 R56.2 U23.12(OUTL)
OUTR: C40.2 CN3.5 R54.1 U23.10(OUTR)
RST: U2.9(IO16) U11.5
SDGATE: Q5.1(G) R23.1
SDVCC: C22.1 Q5.3(D) TF1.4(VDD)
STANDBY: U1.6(STDBY)
U0RXD: RX.1 U2.36(RXD0)
U0TXD: TX.1 U2.37(TXD0)
USB_5V: C4.1 U1.4(VCC) U1.8(CE) U19.A4B9(VBUS) U19.B4A9(VBUS)
USBD+: D+.1 U2.14(IO20) U19.A6(DP1) U19.B6(DP2)
USBD-: D-.1 U2.13(IO19) U19.A7(DN1) U19.B7(DN2)
XSMT: R55.1 U2.33(IO40) U21.17(XSMT) U23.16(SHDN#)
$1N1496: C46.2 R6.2 R10.1 R13.2
$1N2051: R2.2 U1.2(PROG)
$1N2238: C10.1 R34.2 U5.1(VIN) U5.3(CE)
$1N3298: R42.2 U19.A5(CC1)
$1N3304: R41.1 U19.B5(CC2)
$1N3809: R46.1 U20.7(INT)
$1N3816: R45.1 U20.6(CSB)
$1N4145: R14.1 U4.12(INT)
$1N4149: C16.1 U4.20(CPOUT)
$1N4697: C26.1 R47.2 U22.1(VIN) U22.3(CE)
$1N4828: C28.1 U21.18(LDOO)
$1N4950: C29.2 U21.4(CAPM)
$1N4954: C29.1 U21.2(CAPP)
$1N5037: C30.2 U21.5(VNEG)
$1N5556: R50.1 TF1.2(CD/DAT3)
$1N6293: C34.1 U23.2(C1P)
$1N6297: C34.2 U23.4(C1N)
$1N6430: C35.2 U23.5(PVSS)
$1N6524: R51.1 U21.6(OUTL)
$1N6528: R52.1 U21.7(OUTR)
$1N6809: C36.2 U23.11(BIAS)
$1N6942: C37.2 C39.1 R53.1
$1N6975: C38.2 C40.1 R54.2
$1N15354: R60.2 U21.15(LRCK)
$1N15397: R61.2 U21.14(DIN)
$1N15432: R62.2 U21.13(BCK)
Net-(LED1-1): LED1.1(A) R32.2
Net-(LED1-2): LED1.2(C) Q9.3(D)
Net-(LED2-1): LED2.1(A) R33.2
Net-(LED2-2): LED2.2(C) Q8.3(D)
Net-(R18-1): R18.1 SW7.3 SW7.4
Net-(R19-1): R19.1 SW6.3 SW6.4
Net-(R20-1): R20.1 SW5.3 SW5.4

Not connected (* = marked no-connect by the designer): C17 1; CN3 4* 6*; TF1 1(DAT2)* 8(DAT1)*; U4 2(NC) 3(NC) 4(NC) 5(NC) 6(AUX_DA) 7(AUX_CL) 10(REGOUT) 14(NC) 15(NC) 16(NC) 17(NC) 19(RESV) 21(RESV) 22(RESV); U5 4(NC)*; U19 A8(SBU1) B8(SBU2) EP; U22 4(NC)*

## Notes on the sheet
- Power circuitry
- Power circuitry
- I2S
- Reset
- Boot
- EINK

# Board PCB2
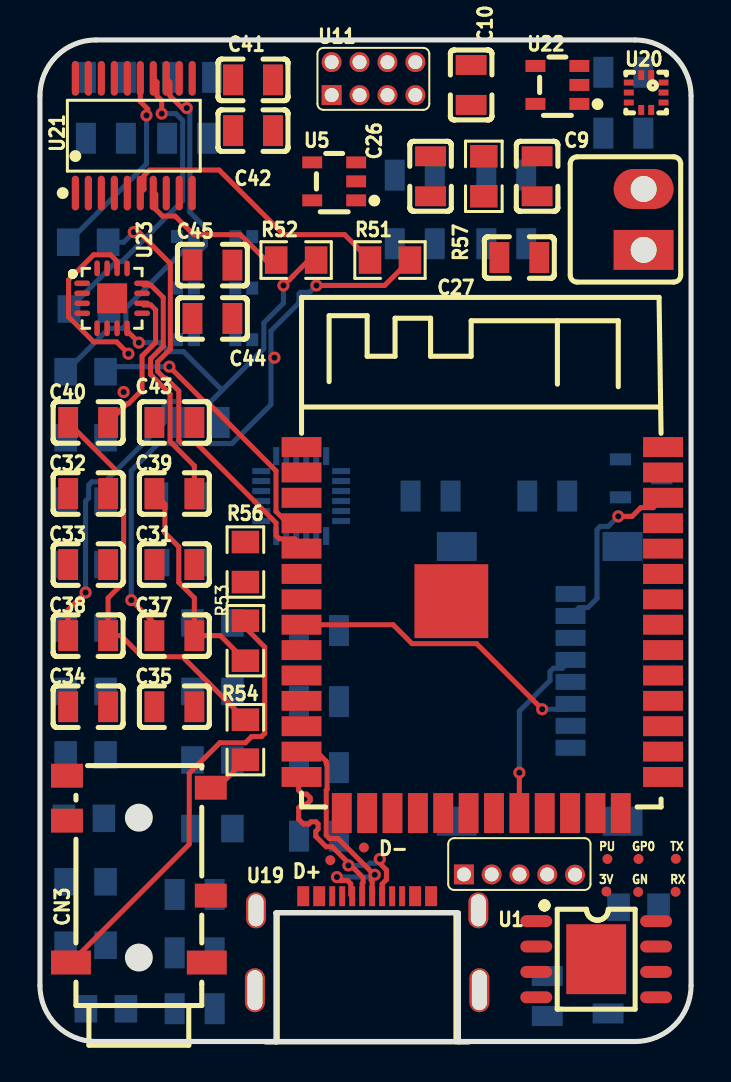
[diagram p2: board, top side]
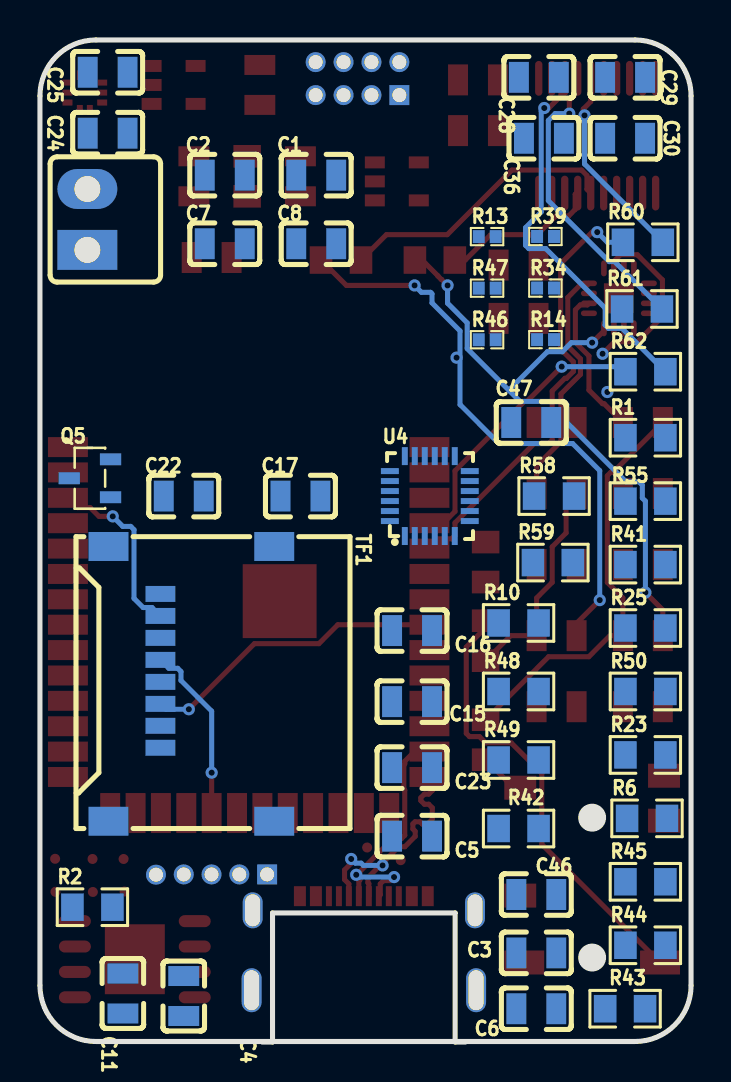
[diagram p3: board, bottom side, seen from below]

Outline 32.6 x 50.15 mm; copper layers: Top Layer, Inner1, Inner2, Inner3, Inner4, Inner5, Inner6, Bottom Layer. Coordinates in mm from the lower left corner of the outline.
Outline path: 0,47.35 0,2.83 arc(0.82,0.85) 2.8,0.03 29.8,0.03 arc(31.78,0.85) 32.6,2.83 32.6,47.35 arc(31.78,49.33) 29.8,50.15 2.8,50.15 arc(0.82,49.33) 0,47.35
Stack: Top Layer 0.035mm Outer layer thickness 1oz / Dielectric1 0.1164mm 2116 RC54% 4.9mil / Inner1 0.0152mm Inner layer thickness / Dielectric2 0.3mm 0.3mm H/HOZ No copper / Inner2 0.0152mm Inner layer thickness / Dielectric3 0.0764mm 1080 RC67% 3.3mil / Dielectric4 0.0764mm 1080 RC67% 3.3mil / Inner3 0.0152mm Inner layer thickness / Dielectric5 0.3mm 0.3mm H/HOZ No copper / Inner4 0.0152mm Inner layer thickness / Dielectric6 0.0764mm 1080 RC67% 3.3mil / Dielectric7 0.0764mm 1080 RC67% 3.3mil / Inner5 0.0152mm Inner layer thickness / Dielectric8 0.3mm 0.3mm H/HOZ No copper / Inner6 0.0152mm Inner layer thickness / Dielectric9 0.1164mm 2116 RC54% 4.9mil / Bottom Layer 0.035mm Outer layer thickness 1oz

## Design rules (mm)
net USBD+: DP1
net USBD-: DP1
template: Custom Config
spacing copperThickness1oz (default): track to track 0.102, other pairs 0.152 to 0.3
spacing copperThickness2oz: track to track 0.203, other pairs 0.152 to 0.3
track width copperThickness1oz (default): min 0.127, default 0.254, max 2.54
track width copperThickness2oz: min 0.203, default 0.254, max 2.54
track width AGND: min 0.454, default 0.5, max 2.54
differential pair differentialPair (default): width min 0.127, default 0.254, max 2.54; gap min 0.152, default 0.152
via viaSize (default): diameter min 0.5, default 0.61, max 10; hole min 0.3, default 0.305, max 6.3
net AGND uses AGND

## Placement (name value [footprint] x y rotation side)
3V  -  [Test-Point-0.5mm]  28.36 7.53 0 top
C1  10u  [C0805]  18.77 43.38 180 bottom
C2  100n  [C0805]  23.35 43.38 180 bottom
C3  100n  [C0805]  7.75 4.46 180 bottom
C4  10uF  [C0805]  25.4 2.3 90 bottom
C5  1u  [C0805]  13.97 10.3 0 bottom
C6  100n  [C0805]  7.75 1.67 180 bottom
C7  100n  [C0805]  23.35 39.95 180 bottom
C8  10u  [C0805]  18.77 39.95 180 bottom
C9  10u  [C0805]  24.89 43.32 270 top
C10  10u  [C0805]  21.59 47.9 270 top
C11  10uF  [C0805]  28.45 2.43 90 bottom
C15  0.1uF  [C0805]  13.97 17.03 180 bottom
C16  2200pF  [C0805]  13.97 20.59 0 bottom
C17  0.1uF  [C0805]  19.56 27.32 180 bottom
C22  100nF  [C0805]  25.4 27.32 180 bottom
C23  1u  [C0805]  13.97 13.73 0 bottom
C24  0.1uF  [C0805]  29.21 45.48 180 bottom
C25  1uF  [C0805]  29.21 48.53 180 bottom
C26  10u  [C0805]  19.56 43.32 90 top
C27  10u  [C0805]  24 39.26 0 top
C28  1uF  [C0805]  7.62 48.28 180 bottom
C29  2.2uF  [C0805]  3.3 48.28 180 bottom
C30  2.2uF  [C0805]  3.3 45.23 180 bottom
C31  1uF  [C0805]  6.73 23.89 0 top
C32  1uF  [C0805]  2.41 27.45 0 top
C33  1uF  [C0805]  2.41 23.89 0 top
C34  1uF  [C0805]  2.41 16.78 0 top
C35  1uF  [C0805]  6.73 16.78 0 top
C36  1uF  [C0805]  7.37 45.23 0 bottom
C37  2.2uF  [C0805]  6.73 20.34 0 top
C38  2.2uF  [C0805]  2.41 20.34 0 top
C39  47pF  [C0805]  6.73 27.45 0 top
C40  47pF  [C0805]  2.41 31 0 top
C41  0.1uF  [C0805]  10.67 48.15 180 top
C42  10uF  [C0805]  10.67 45.61 180 top
C43  2.2uF  [C0805]  6.73 31 180 top
C44  0.1uF  [C0805]  8.64 36.21 180 top
C45  10uF  [C0805]  8.64 38.88 0 top
C46  0.1uF  [C0805]  7.75 7.38 180 bottom
C47  1u  [C0805]  8 31 180 bottom
CN3  HX PJ-342  [AUDIO-SMD_HX-PJ-342M]  4.95 8.65 90 top
D+  -  [Test-Point-0.5mm]  14.54 9.1 0 top
D-  -  [Test-Point-0.5mm]  16.22 9.73 0 top
GN  -  [Test-Point-0.5mm]  29.95 7.51 0 top
GP0  -  [Test-Point-0.5mm]  29.97 9.16 0 top
PU  -  [Test-Point-0.5mm]  28.41 9.16 0 top
Q5  AO3401  [SOT-23-3_L2.9-W1.4-P1.90-LS2.5-BR]  30.1 28.21 180 bottom
R1  10k  [R0805]  2.29 30.24 180 bottom
R2  1.2k  [R0805]  29.97 6.75 180 bottom
R6  100k  [R0805]  2.2 11.19 180 bottom
R10  100k  [R0805]  8.64 20.97 180 bottom
R13  0  [0402]  10.21 40.31 180 bottom
R14  0  [0402]  7.28 35.15 180 bottom
R23  10k  [R0805]  2.29 14.37 180 bottom
R25  10k  [R0805]  2.29 20.72 180 bottom
R34  0  [0402]  7.28 37.73 180 bottom
R39  0  [0402]  7.28 40.31 180 bottom
R41  5.1K  [R0805]  2.29 23.89 180 bottom
R42  5.1K  [R0805]  8.64 10.68 180 bottom
R43  4.7K  [R0805]  3.3 1.67 180 bottom
R44  4.7K  [R0805]  2.29 4.84 180 bottom
R45  10k  [R0805]  2.29 8.02 180 bottom
R46  0  [0402]  10.21 35.15 180 bottom
R47  0  [0402]  10.21 37.73 180 bottom
R48  10k  [R0805]  8.64 17.54 180 bottom
R49  10k  [R0805]  8.64 14.11 180 bottom
R50  10k  [R0805]  2.29 17.54 180 bottom
R51  10K  [R0805]  17.53 39.13 0 top
R52  10K  [R0805]  12.83 39.13 0 top
R53  10K  [R0805]  10.29 20.08 90 top
R54  10K  [R0805]  10.29 15.13 90 top
R55  10K  [R0805]  2.29 27.07 0 bottom
R56  4.7k  [R0805]  10.29 24.02 270 top
R57  0  [R0805]  22.22 43.32 90 top
R58  10K  [R0805]  6.86 27.32 180 bottom
R59  10K  [R0805]  6.92 23.99 180 bottom
R60  22  [R0805]  2.41 40.02 180 bottom
R61  22  [R0805]  2.46 36.68 180 bottom
R62  22  [R0805]  2.29 33.54 180 bottom
RX  -  [Test-Point-0.5mm]  31.82 7.52 0 top
TF1  TF-CARD XG8P H1.5  [TF-SMD_TF-CARD-XG8P-H1.5]  25.02 17.92 270 bottom
TX  -  [Test-Point-0.5mm]  31.84 9.17 0 top
U1  TP4056-MS  [SOP-8_L4.9-W3.9-P1.27-LS6.0-TL-EP]  27.85 4.14 0 top
U2  -  [ESP32-S3-WROOM-1]  22.1 20.46 0 top
U4  MPU6050_C9900042518  [QFN-24_L4.0-W4.0-P0.50-BL]  13.08 27.32 180 bottom
U5  XC6220B331MR  [SOT-23-5_L2.9-W1.6-P0.95-LS2.8-BR]  14.73 43.07 0 top
U11  -  [HDR-TH_8P-P0.6]  16.26 47.13 0 top
U16  -  [Battery Connector Nebula]  30.23 40.78 90 top
U19  HX TYPE-C 16P CB1.6  [USB-C-SMD_HX-TYPE-C-16PCB1.6]  16.38 4.72 0 top
U20  BMP388  [SENSORM-SMD_BMP388]  30.35 47.51 0 top
U21  PCM5102APW  [TSSOP-20_L6.5-W4.4-P0.65-LS6.4-BL]  4.7 45.36 0 top
U22  XC6220B331MR  [SOT-23-5_L2.9-W1.6-P0.95-LS2.8-BR]  25.91 47.9 0 top
U23  MAX97220AETE+T  [QFN-16_L3.0-W3.0-P0.50-BL-EP1.5]  3.61 37.22 270 top
U24  -  [Nebula buttons board]  24 9.03 0 top

## Footprints (pads in the part's own frame, mm; a bottom-side part is the same pattern mirrored in y, then rotated)
0402
  rect 0.6x0.65 smd: 1(-0.424,0) 2(0.424,0)
AUDIO-SMD_HX-PJ-342M
  rect 1.2x2 smd: 1(-4.675,-3.4) 2(-4.675,3.4)
  rect 1.2x1.6 smd: 3(-1.325,-3.6) 4(2.425,3.6) 5(4.075,-3.6) 6(4.675,3.6)
Battery Connector Nebula
  rect 2x3 hole 1.3: 1(-1.143,0)
  oval 2x3 hole 1.3: 2(1.905,0)
C0805
  rect 1x1.55 smd: 1(-1,0) 2(1,0)
ESP32-S3-WROOM-1
  rect 2x1 smd: 1(-9,9.31) 2(-9,8.04) 3(-9,6.77) 4(-9,5.5) 5(-9,4.23) 6(-9,2.96) 7(-9,1.69) 8(-9,0.42) 9(-9,-0.85) 10(-9,-2.12) 11(-9,-3.39) 12(-9,-4.66) 13(-9,-5.93) 14(-9,-7.2) 27(9.1,-7.2) 28(9.1,-5.93) 29(9.1,-4.66) 30(9.1,-3.39) 31(9.1,-2.12) 32(9.1,-0.85) 33(9.1,0.42) 34(9.1,1.69) 35(9.1,2.96) 36(9.1,4.23) 37(9.1,5.5) 38(9.1,6.77) 39(9.1,8.04) 40(9.1,9.31)
  rect 1x2 smd: 15(-6.985,-9.005) 16(-5.715,-9.005) 17(-4.445,-9.005) 18(-3.175,-9.005) 19(-1.905,-9.005) 20(-0.635,-9.005) 21(0.635,-9.005) 22(1.905,-9.005) 23(3.175,-9.005) 24(4.445,-9.005) 25(5.715,-9.005) 26(6.985,-9.005)
  rect 3.7x3.7 smd: 41(-1.5,1.6)
HDR-TH_8P-P0.6
  rect 1x1 hole 0.7: 1(-1.651,0.254)
  round 1 hole 0.7: 2(-0.254,0.254) 3(1.143,0.254) 4(2.54,0.254) 5(2.54,1.905) 6(1.143,1.905) 7(-0.254,1.905) 8(-1.651,1.905)
Nebula buttons board
  rect 1x1 hole 0.7: 1(-2.776,-0.646)
  round 1 hole 0.7: 2(-1.385,-0.646) 3(0.006,-0.646) 4(1.397,-0.646) 5(2.788,-0.659)
QFN-16_L3.0-W3.0-P0.50-BL-EP1.5
  oval 0.28x0.8 smd: 1(-0.75,-1.5) 2(-0.25,-1.5) 3(0.25,-1.5) 4(0.75,-1.5) 9(0.75,1.5) 10(0.25,1.5) 11(-0.25,1.5) 12(-0.75,1.5)
  oval 0.8x0.28 smd: 5(1.5,-0.75) 6(1.5,-0.25) 7(1.5,0.25) 8(1.5,0.75) 13(-1.5,0.75) 14(-1.5,0.251) 15(-1.5,-0.249) 16(-1.5,-0.75)
  rect 1.5x1.5 smd: 17(0,0)
QFN-24_L4.0-W4.0-P0.50-BL
  rect 0.3x0.9 smd: 1(-1.25,-2) 2(-0.75,-2) 3(-0.25,-2) 4(0.25,-2) 5(0.75,-2) 6(1.25,-2) 13(1.25,2) 14(0.75,2) 15(0.25,2) 16(-0.25,2) 17(-0.75,2) 18(-1.25,2)
  rect 0.9x0.3 smd: 7(2,-1.25) 8(2,-0.75) 9(2,-0.25) 10(2,0.25) 11(2,0.75) 12(2,1.25) 19(-2,1.25) 20(-2,0.75) 21(-2,0.25) 22(-2,-0.25) 23(-2,-0.75) 24(-2,-1.25)
R0805
  rect 1.133x1.377 smd: 1(-1,0) 2(1,0)
SENSORM-SMD_BMP388
  rect 0.3x0.5 smd: 1(0.25,0.871) 2(-0.25,0.871) 6(-0.25,-0.871) 7(0.25,-0.871)
  rect 0.5x0.3 smd: 3(-0.869,0.5) 4(-0.869,0) 5(-0.869,-0.5) 8(0.869,-0.5) 9(0.869,0) 10(0.869,0.5)
SOP-8_L4.9-W3.9-P1.27-LS6.0-TL-EP
  oval 1.6x0.6 smd: 1(-3,1.905) 2(-3,0.635) 3(-3,-0.635) 4(-3,-1.905) 5(3,-1.905) 6(3,-0.635) 7(3,0.635) 8(3,1.905)
  rect 3x3.5 smd: 9(0,0)
SOT-23-3_L2.9-W1.4-P1.90-LS2.5-BR
  rect 1.07x0.6 smd: 1(1.035,-0.95) 2(1.035,0.95) 3(-1.035,0)
SOT-23-5_L2.9-W1.6-P0.95-LS2.8-BR
  rect 1x0.6 smd: 1(1.1,-0.95) 2(1.1,0) 3(1.1,0.95) 4(-1.1,0.95) 5(-1.1,-0.95)
Test-Point-0.5mm
  round 0.5 smd: 1(0,0)
TF-SMD_TF-CARD-XG8P-H1.5
  rect 0.8x1.5 smd: 1(3.2,-1.55) 2(2.1,-1.55) 3(1,-1.55) 4(-0.1,-1.55) 5(-1.2,-1.55) 6(-2.3,-1.55) 7(-3.4,-1.55) 8(-4.5,-1.55)
  rect 1.45x2 smd: 9(-6.875,4.15) 10(-6.875,-4.15) 11(6.875,-4.15) 12(6.875,4.15)
TSSOP-20_L6.5-W4.4-P0.65-LS6.4-BL
  oval 0.364x1.742 smd: 1(-2.925,-2.871) 2(-2.275,-2.871) 3(-1.625,-2.871) 4(-0.975,-2.871) 5(-0.325,-2.871) 6(0.325,-2.871) 7(0.975,-2.871) 8(1.625,-2.871) 9(2.275,-2.871) 10(2.925,-2.871) 11(2.925,2.871) 12(2.275,2.871) 13(1.625,2.871) 14(0.975,2.871) 15(0.325,2.871) 16(-0.325,2.871) 17(-0.975,2.871) 18(-1.625,2.871) 19(-2.275,2.871) 20(-2.925,2.871)
USB-C-SMD_HX-TYPE-C-16PCB1.6
  rect 0.6x1 smd: A1B12(-3.2,2.583) A4B9(-2.4,2.583) B1A12(3.2,2.583) B4A9(2.4,2.583)
  rect 0.3x1 smd: A5(-1.25,2.583) A6(-0.25,2.583) A7(0.25,2.583) A8(-1.75,2.583) B5(1.75,2.583) B6(0.75,2.583) B7(-0.75,2.583) B8(1.25,2.583)
  oval 1x2.2 hole 0.75x2: EP(-5.62,-2.123) EP(5.62,-2.123)
  oval 1x1.8 hole 0.75x1.6: EP(-5.565,1.875) EP(5.565,1.875)

## Nets
As in the schematic.

Pads without a net: C17 1; CN3 4 6; TF1 1 8; U4 2 3 4 5 6 7 14 15 16 17 19 21 22; U5 4; U19 A8 B8 EP; U22 4

## Via types
v1: diameter 0.61, hole 0.305, Top Layer to Bottom Layer, 20 vias

## Routing (per net, layer and track width the routed paths; a pad name or vN(x,y) marks a point on that pad's centre or on a via; arc(x,y) is an arc through that point)
BCK: length 14.3
  Top Layer w0.254: 13.1,26.09 12.28,26.09 11.82,26.55 11.82,28.59 8.35,32.06 8.22,32.06 v1(6.48,33.8)
  Bottom Layer w0.254: v1(6.48,33.8) 3.54,33.8 R62.1
CLK: length 9
  Top Layer w0.254: U2.22 v1(24,13.48)
  Bottom Layer w0.254: TF1.5 26.15,18.7 25.7,18.7 25.54,18.54 25.54,18.09 24,16.56 v1(24,13.48)
CMD: length 15.3
  Top Layer w0.254: U2.8 17.68,20.88 18.63,19.93 21.86,19.93 v1(25.15,16.65)
  Bottom Layer w0.254: v1(25.15,16.65) 26.3,16.65 TF1.3
DAT0: length 9.1
  Top Layer w0.254: v1(28.96,26.31) 29.65,26.31 30.08,26.74 30.71,26.74 31.2,27.23
  Bottom Layer w0.254: TF1.7 26.99,21.74 27.43,21.74 27.89,22.2 27.89,25.64 28.05,25.8 28.45,25.8 v1(28.96,26.31)
INL-: length 46
  Top Layer w0.254: v1(4.43,34.44) 3.84,35.04 2.69,35.04 1.43,36.29 1.43,38.14 2.69,39.4 3.54,39.4 3.86,39.07 U23.14 ; v1(13.84,37.86) 17.26,37.86 R51.2 ; C37.1 5.73,20.96 v1(4.57,22.11)
  Inner2 w0.254: v1(4.43,34.44) 4.68,34.44 4.71,34.42 5.19,34.42 5.29,34.32 6.17,34.32 6.23,34.38 6.72,34.38 6.85,34.25 v1(11.74,34.25)
  Bottom Layer w0.254: v1(4.57,22.11) 4.57,28.59 5.93,29.95 9.62,29.95 11.56,31.9 11.56,35.58 12.97,36.99 12.97,37.44 13.05,37.52 13.5,37.52 v1(13.84,37.86)
INR-: length 31.9
  Top Layer w0.254: C38.1 1.41,21.62 v1(2.29,22.5) ; 4.36,35.72 4.36,35.59 v1(4.95,35) ; R52.2 13.46,39.13 12.67,38.34 12.67,38.33 12.51,38.17 12.49,38.17 v1(12.19,37.86)
  Bottom Layer w0.254: v1(12.19,37.86) 12.19,36.97 11.21,35.99 11.21,34.7 9.12,32.62 ; 9.12,32.62 8.56,32.06 6.39,32.06 6.22,31.9 6.22,31 3.25,28.04 2.6,28.04 2.44,27.87 2.44,27.22 2.29,27.07 v1(2.29,22.5) ; 9.12,32.62 7.19,34.55 6.44,34.55 5.99,35 v1(4.95,35)
LRCK: length 22.3
  Top Layer w0.254: v1(4.7,40.53) 4.95,40.53 6.53,38.95 6.53,34.68 5.89,34.04 5.89,33.56 6.23,33.21 6.32,33.21 6.95,32.58 6.95,30.11 7.12,29.95 7.85,29.95 11.82,25.98 11.82,25.35 11.98,25.18 12.74,25.18 13.1,24.83 13.1,24.82
  Bottom Layer w0.254: v1(4.7,40.53) 4.19,40.02 R60.1
OUTL: length 34.9
  Top Layer w0.254: C39.2 7.73,28.83 6.51,30.05 6.51,32.43 5.54,33.41 5.54,34.19 6.17,34.82 6.17,37.26 5.55,37.89 5.19,37.89 U23.12 ; CN3.2 7.47,9.9 7.47,13.44 9.01,14.98 10.29,14.98 10.6,15.28 11.09,15.28 11.25,15.45 11.25,19.76 10.29,20.73 R53.2
  vias: v1(4.19,32.53)
OUTR: length 9.8
  Top Layer w0.254: U23.10 5.19,36.89 5.55,36.89 5.79,36.64 5.79,35.01 5.11,34.33 5.11,32.62 4.43,31.94 4.35,31.94 C40.2 ; R54.1 8.88,12.73 CN3.5
USBD+: length 12.8
  Top Layer w0.254: U19.B6 17.13,7.91 17.35,8.13 17.35,8.61 17.02,8.94 v1(17.02,9.16) ; U19.A6 16.13,7.93 16.18,7.97 16.18,8.23 14.63,9.77 14.33,9.77 13.81,10.29 13.81,10.55 13.93,10.66 13.93,10.92 13.82,11.02 13.57,11.02 13.45,10.9 13.2,10.9 12.95,11.15 12.95,11.72 13.13,11.9 13.35,11.9 13.53,12.08 13.53,12.23 13.35,12.41 13.13,12.41 12.95,12.59 12.95,13.25 13.1,13.39
  Bottom Layer w0.254: v1(17.02,9.16) 16.81,8.95 16.52,8.95 16.41,8.84 v1(15.44,8.84)
USBD-: length 12.9
  Top Layer w0.254: v1(14.87,8.25) 15.05,8.08 15.4,8.08 15.56,7.91 15.56,7.37 U19.B7 ; 13.1,14.66 13.72,14.66 14.33,14.05 14.33,13.92 14.38,13.88 14.38,12.65 14.33,12.61 14.33,10.34 14.5,10.18 14.8,10.18 14.8,10.18 14.93,10.18 16.59,8.52 16.59,8.1 16.63,8.05 U19.A7
  Bottom Layer w0.254: v1(16.76,8.37) 16.65,8.25 v1(14.87,8.25)
$1N6524: length 14.2
  Top Layer w0.254: U21.6 5.21,42.67 5.21,43.36 5.48,43.63 8.97,43.63 12.21,40.4 15.26,40.4 R51.1
$1N6528: length 8
  Top Layer w0.254: R52.1 11.31,39.13 10.04,40.4 7.7,40.4 6.77,41.33 6.13,41.33 5.8,41.67 5.8,42.42 5.74,42.48 5.67,42.48
$1N6942: length 11
  Top Layer w0.254: R53.1 9.03,20.34 C37.2 7.73,22.22 6.95,23 6.95,24.78 6.26,25.48 6.26,26.92 C39.1
$1N6975: length 20.8
  Top Layer w0.254: R54.2 7.13,19.28 5.12,19.28 4.06,20.34 C38.2 3.41,22.22 4.19,23 4.19,28.34 4.03,28.5 3.91,28.5 C40.1
$1N15354: length 10
  Top Layer w0.254: U21.15 5.02,47.06 5.4,46.69 5.4,46.44 v1(5.33,46.37)
  Bottom Layer w0.254: v1(5.33,46.37) 5.33,43.94 R60.2
$1N15397: length 15.1
  Top Layer w0.254: 5.67,48.23 5.86,48.04 5.86,47.35 6.1,47.11 v1(6.1,46.46)
  Bottom Layer w0.254: v1(6.1,46.46) 6.8,46.46 7.14,46.12 7.14,42.1 4.09,39.05 3.83,39.05 R61.2
$1N15432: length 19.4
  Top Layer w0.254: U21.13 6.51,48.04 6.51,47.35 7.12,46.74 v1(7.35,46.74)
  Bottom Layer w0.254: v1(7.35,46.74) 7.5,46.59 7.5,41.54 8.29,40.75 8.29,39.87 8.12,39.71 7.28,39.71 4.3,36.73 4.3,35.88 4.14,35.72 3.46,35.72 R62.2
